# EAGLE schematic CC2650_BLE (EAGLE 6.6.0)
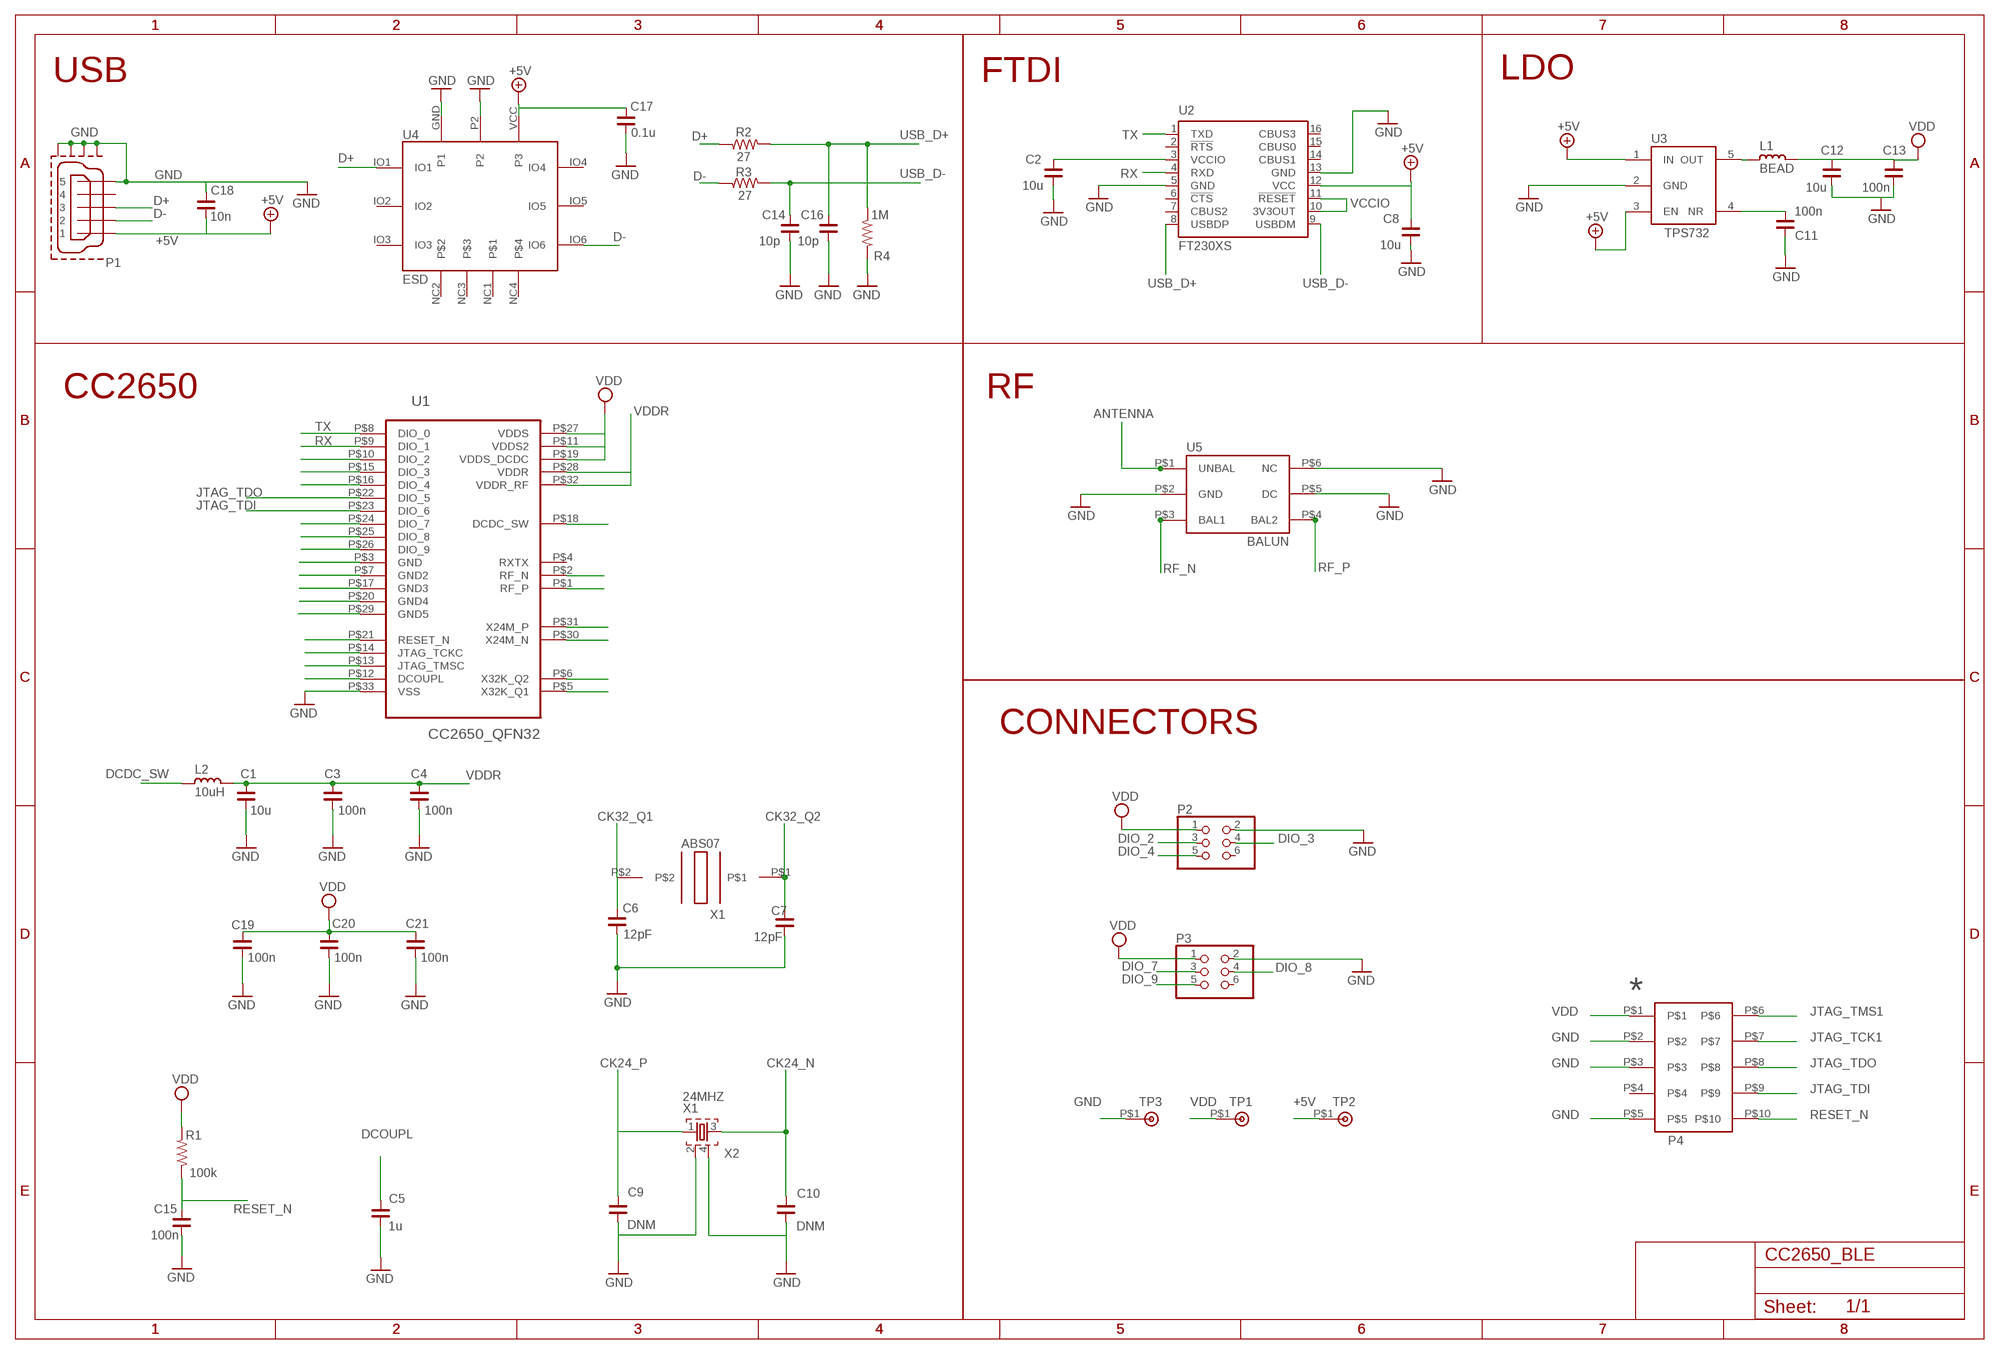
[diagram p0: schematic, sheet 1]

## Parts
24MHZ  X1  FA-20H  [FA-20H]
32KHZ  OSC32K  [ABS07]
C1  10u  C_0402  [C0402]
C2  10u  C_0402  [C0402]
C3  100n  C_0402  [C0402]
C4  100n  C_0402  [C0402]
C5  1u  C_0402  [C0402]
C6  12pF  C_0402  [C0402]
C7  12pF  C_0402  [C0402]
C8  10u  C_0402  [C0402]
C9  DNM  C_0402  [C0402]
C10  DNM  C_0402  [C0402]
C11  100n  C_0402  [C0402]
C12  10u  C_0402  [C0402]
C13  100n  C_0402  [C0402]
C14  10p  C_0402  [C0402]
C15  100n  C_0402  [C0402]
C16  10p  C_0402  [C0402]
C17  0.1u  C_0402  [C0402]
C18  10n  C_0402  [C0402]
C19  100n  C_0402  [C0402]
C20  100n  C_0402  [C0402]
C21  100n  C_0402  [C0402]
L1  BEAD  L_0402  [L0402]
L2  10uH  L_0402  [L0402]
P2  PINHD-2X3  [2X03]
P3  PINHD-2X3  [2X03]
R1  100k  R_0603  [R0603]
R2  27  R_0603  [R0603]
R3  27  R_0603  [R0603]
R4  1M  R_0603  [R0603]
TP1  VDD  TEST_POINT  [5019_PAD]
TP2  +5V  TEST_POINT  [5019_PAD]
TP3  GND  TEST_POINT  [5019_PAD]
U2  FT230XS  [SSOP16]
U3  TPS732XX  [SOT23]
U4  ESD  [ESD]
U5  BALUN_NRF8001  [BALUNNORDIC]
U$3  CC26504X4  [CC26504X4]
U$5  FTSH-105-01-L-DV-K  [FTSH-105-01-L-DV-K]
USB  MINI-USB-SHIELD-UX60-MB-5ST  [UX60-MB-5ST]

## Nets
+3.3RAW: L1.2 U3.5(OUT)
+5V [power]: C8.2 C17.2 C18.1 TP2.P$1(TEST) U2.12(VCC) U3.1(IN) U3.3(EN) U4.VCC(P3) USB.1
ANTENNA: U5.P$1(UNBAL)
CK24_N: 24MHZ.3 C10.1 U$3.P$30(X24M_N)
CK24_P: 24MHZ.1 C9.1 U$3.P$31(X24M_P)
CK32_Q1: 32KHZ.P$2 C6.1 U$3.P$5(X32K_Q1)
CK32_Q2: 32KHZ.P$1 C7.1 U$3.P$6(X32K_Q2)
D+: R2.1 U4.IO1 USB.3
D-: R3.1 U4.IO6 USB.2
DCDC_SW: L2.2 U$3.P$18(DCDC_SW)
DCOUPL: C5.2 U$3.P$12(DCOUPL)
DIO_2: P2.3 U$3.P$10(DIO_2)
DIO_3: P2.4 U$3.P$15(DIO_3)
DIO_4: P2.5 U$3.P$16(DIO_4)
DIO_7: P3.3 U$3.P$24(DIO_7)
DIO_8: P3.4 U$3.P$25(DIO_8)
DIO_9: P3.5 U$3.P$26(DIO_9)
GND: 24MHZ.2 24MHZ.4 C1.1 C2.1 C3.1 C4.1 C5.1 C6.2 C7.2 C8.1 C9.2 C10.2 C11.1 C12.1 C13.1 C14.1 C15.1 C16.1 C17.1 C18.2 C19.1 C20.1 C21.1 P2.2 P3.2 R4.2 TP3.P$1(TEST) U2.5(GND) U2.13(GND) U3.2(GND) U4.GND(P1) U4.P2 U5.P$2(GND) U5.P$5(DC) U5.P$6(NC) U$3.P$3(GND) U$3.P$7(GND2) U$3.P$17(GND3) U$3.P$20(GND4) U$3.P$33(VSS) U$5.P$2 U$5.P$3 U$5.P$5 USB.5 USB.M1(GND1) USB.M2(GND2) USB.M3(GND3) USB.M4(GND4)
JTAG_TCK1: U$3.P$14(JTAG_TCKC) U$5.P$7
JTAG_TDI: U$3.P$23(DIO_6) U$5.P$9
JTAG_TDO: U$3.P$22(DIO_5) U$5.P$8
JTAG_TMS1: U$3.P$13(JTAG_TMSC) U$5.P$6
N$25: U$3.P$29(GND5)
N$47: C11.2 U3.4(NR)
RESET_N: C15.2 R1.1 U$3.P$21(RESET_N) U$5.P$10
RF_N: U5.P$3(BAL1) U$3.P$2(RF_N)
RF_P: U5.P$4(BAL2) U$3.P$1(RF_P)
RX: U2.4(RXD) U$3.P$9(DIO_1)
TX: U2.1(TXD) U$3.P$8(DIO_0)
USB_D+: C16.2 R2.2 R4.1 U2.8(USBDP)
USB_D-: C14.2 R3.2 U2.9(USBDM)
VCCIO: C2.2 U2.3(VCCIO) U2.10(3V3OUT) U2.11(!RESET)
VDD: C12.2 C13.2 C19.2 C20.2 C21.2 L1.1 P2.1 P3.1 R1.2 TP1.P$1(TEST) U$3.P$11(VDDS2) U$3.P$19(VDDS_DCDC) U$3.P$27(VDDS) U$5.P$1
VDDR: C1.2 C3.2 C4.2 L2.1 U$3.P$28(VDDR) U$3.P$32(VDDR_RF)
Unconnected: P2.6 P3.6 U2.2(!RTS) U2.6(!CTS) U2.7(CBUS2) U2.14(CBUS1) U2.15(CBUS0) U2.16(CBUS3) U4.IO2 U4.IO3 U4.IO4 U4.IO5 U4.NC1 U4.NC2 U4.NC3 U4.NC4 U$3.P$4(RXTX) U$5.P$4 USB.4

## Notes on the sheet
- USB | FTDI | LDO
- P1
- CC2650 | RF
- CONNECTORS
- X1
- P4
- X2

## Library data of the parts
24MHZ = crystal:FA-: MHz RANGE CRYSTAL UNIT Source: Epson Toyocom
32KHZ = ABS07:OSC32K
C1-C21 = rc-master-smd:C_: NON-POLARIZED CAP
L1 L2 = rc-master-smd:L_: INDUCTOR
P2 P3 = pinhead:PINHD-2X3: PIN HEADER
R1-R4 = rc-master-smd:R_: RESISTOR
TP1-TP3 = TEST_POINT_KEYSTONE_5019:TEST_POINT
U2 = ftdichip:FT230X: USB to BASIC UART IC Auto generated by make-symbol-device-package-bsdl.ulp Rev. 43 Source: Data sheet <http://www.ftdichip.com/Support/Documents/DataSheets/ICs/DS_FT230X.pdf>
U3 = TPS732xx:TPS732XX
U4 = ESD_QFN_12:ESD
U5 = 24550BM15A0002_balunNRF8001:BALUN_NRF8001
U$3 = CC2650:CC26504X4
U$5 = Samtec:FTSH-105-01-L-DV-K
USB = usb_con-update:MINI-USB-SHIELD-: MINI USB Connector Source: http://www.hirose.co.jp/cataloge_hp/e24000019.pdf

## Net classes
1 power: width 0.203 mm, clearance 0.127 mm